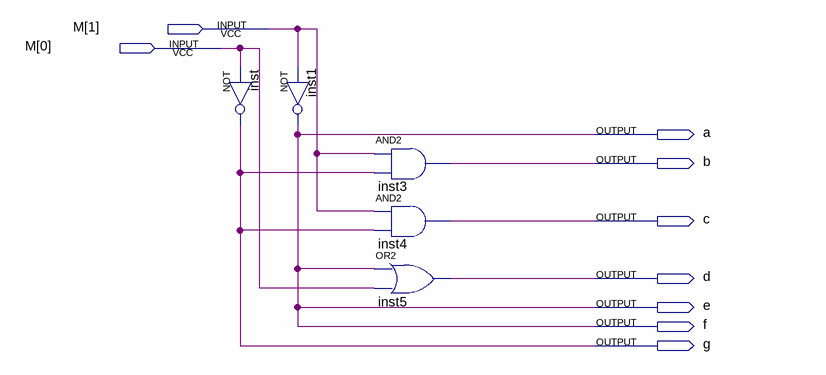
[diagram p0: schematic sheet]
// Quartus schematic DModo.bdf as structural Verilog: 5 symbols, 9 pins
module DModo (
  input  [1:0] M,
  output a,
  output b,
  output c,
  output d,
  output e,
  output f,
  output g
);

  not inst (g, M[0]);
  not inst1 (a, M[1]);
  and inst3 (b, M[1], g);
  and inst4 (c, M[1], g);
  or inst5 (d, a, M[0]);

  assign e = a;
  assign f = a;
endmodule
